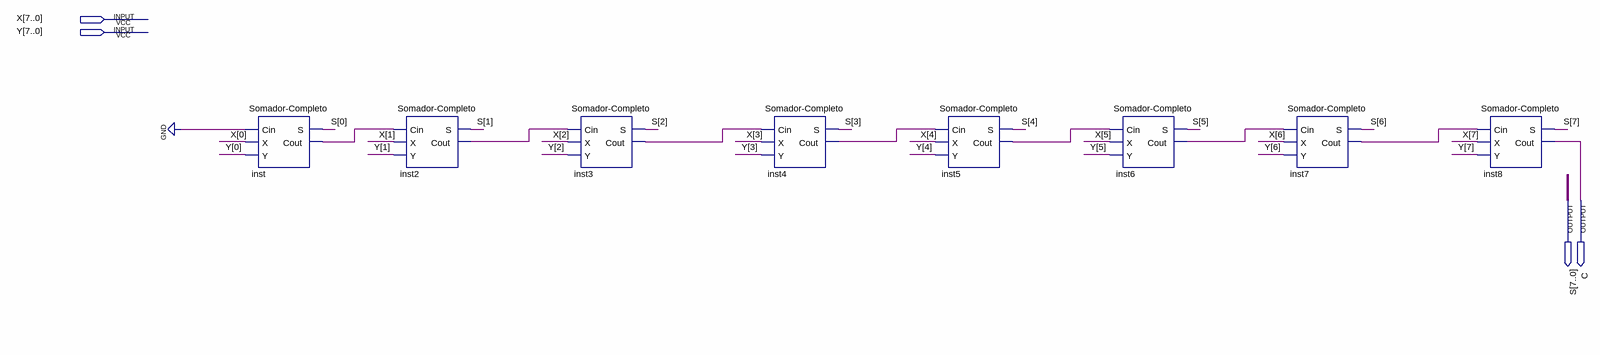
[diagram p0: schematic sheet]
// Quartus schematic Somador-8b.bdf as structural Verilog: 8 symbols, 4 pins
module \Somador-8b  (
  input  [7:0] X,
  input  [7:0] Y,
  output [7:0] S,
  output C
);

  wire inst2_cout, inst3_cout, inst4_cout, inst5_cout, inst6_cout, inst7_cout, inst_cout;

  \Somador-Completo  inst (.Cin(1'b0), .X(X[0]), .Y(Y[0]), .S(S[0]), .Cout(inst_cout));
  \Somador-Completo  inst2 (.Cin(inst_cout), .X(X[1]), .Y(Y[1]), .S(S[1]), .Cout(inst2_cout));
  \Somador-Completo  inst3 (.Cin(inst2_cout), .X(X[2]), .Y(Y[2]), .S(S[2]), .Cout(inst3_cout));
  \Somador-Completo  inst4 (.Cin(inst3_cout), .X(X[3]), .Y(Y[3]), .S(S[3]), .Cout(inst4_cout));
  \Somador-Completo  inst5 (.Cin(inst4_cout), .X(X[4]), .Y(Y[4]), .S(S[4]), .Cout(inst5_cout));
  \Somador-Completo  inst6 (.Cin(inst5_cout), .X(X[5]), .Y(Y[5]), .S(S[5]), .Cout(inst6_cout));
  \Somador-Completo  inst7 (.Cin(inst6_cout), .X(X[6]), .Y(Y[6]), .S(S[6]), .Cout(inst7_cout));
  \Somador-Completo  inst8 (.Cin(inst7_cout), .X(X[7]), .Y(Y[7]), .S(S[7]), .Cout(C));
endmodule
